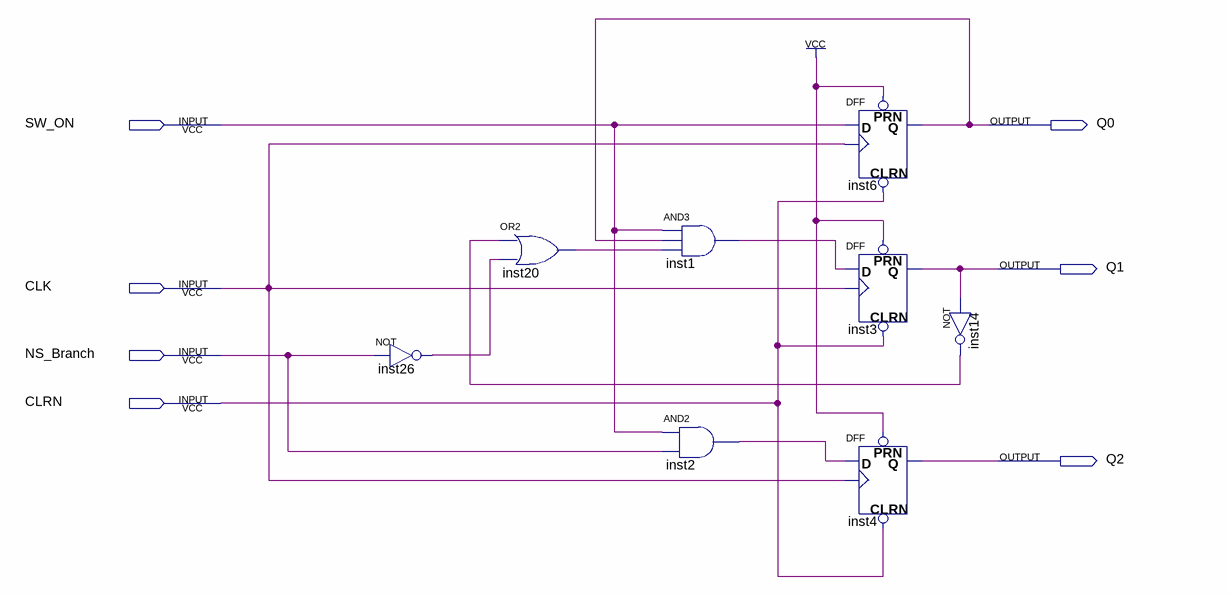
[diagram p0: schematic sheet]
// Quartus schematic State_Machine.bdf as structural Verilog: 8 symbols, 7 pins
module State_Machine (
  input  SW_ON,
  input  CLK,
  input  NS_Branch,
  input  CLRN,
  output Q0,
  output Q1,
  output Q2
);

  wire inst1_out, inst2_out, inst14_out, inst20_out, inst26_out;

  not inst26 (inst26_out, NS_Branch);
  or inst20 (inst20_out, inst14_out, inst26_out);
  and inst1 (inst1_out, SW_ON, Q0, inst20_out);
  and inst2 (inst2_out, SW_ON, NS_Branch);
  DFF inst6 (.CLRN(CLRN), .CLK(CLK), .D(SW_ON), .PRN(1'b1), .Q(Q0));
  DFF inst3 (.CLRN(CLRN), .CLK(CLK), .D(inst1_out), .PRN(1'b1), .Q(Q1));
  DFF inst4 (.CLRN(CLRN), .CLK(CLK), .D(inst2_out), .PRN(1'b1), .Q(Q2));
  not inst14 (inst14_out, Q1);
endmodule
